# Altium schematic sheet Msi001.SchDoc
size A3
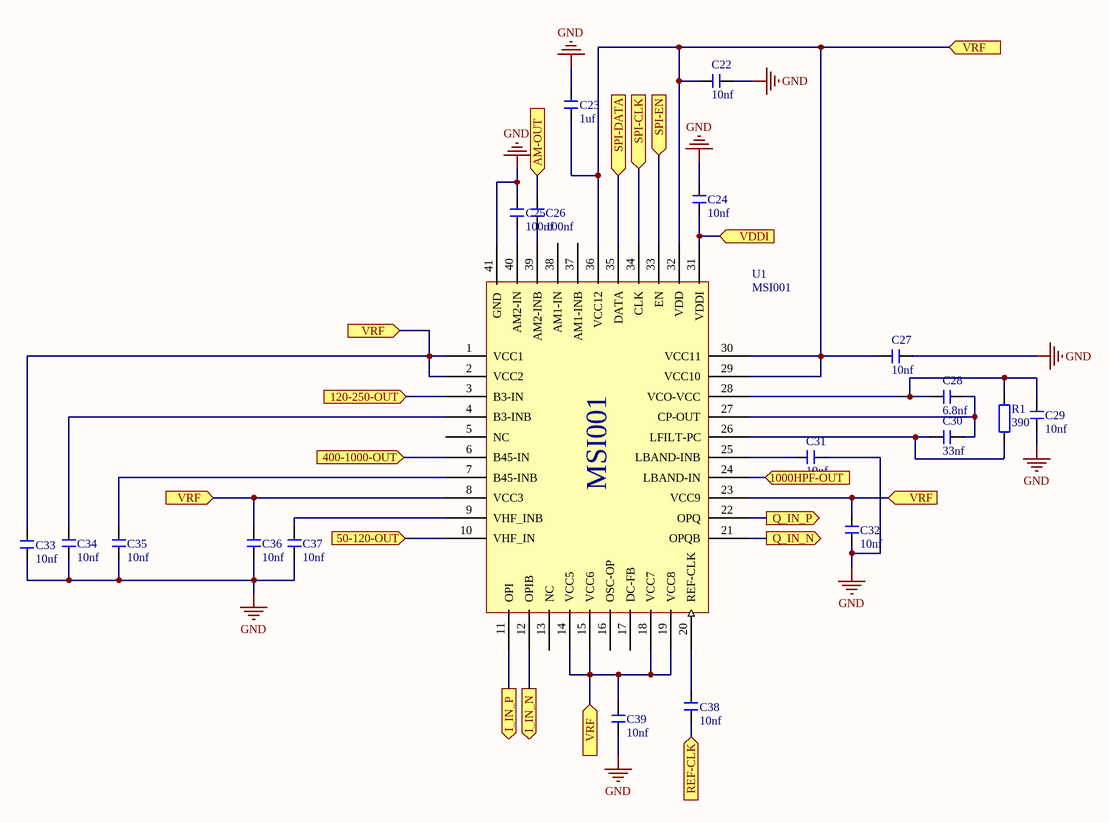
[diagram p0: Msi001.SchDoc]

## Parts
C22  10nf  [C 0603_M]
C23  1uf  [C 0603_M]
C24  10nf  [C 0603_M]
C25  100nf  [C 0603_M]
C26  100nf  [C 0603_M]
C27  10nf  [C 0603_M]
C28  6.8nf  [C 0603_M]
C29  10nf  [C 0603_M]
C30  33nf  [C 0603_M]
C31  10nf  [C 0603_M]
C32  10nf  [C 0603_M]
C33  10nf  [C 0603_M]
C34  10nf  [C 0603_M]
C35  10nf  [C 0603_M]
C36  10nf  [C 0603_M]
C37  10nf  [C 0603_M]
C38  10nf  [C 0603_M]
C39  10nf  [C 0603_M]
R1  390  [R 0603_M]
U1  MSI001  [QFN40 6X6_M]

## Ports
50-120-OUT (in), 120-250-OUT (in), 400-1000-OUT (in), 1000HPF-OUT (in), AM-OUT (in), I_IN_N (out), I_IN_P (out), Q_IN_N (out), Q_IN_P (out), REF-CLK (in), SPI-CLK (in), SPI-DATA (in), SPI-EN (in), VDDI (in), VRF (in)

## Nets
GND: C22.1 C23.2 C24.2 C25.2 C27.1 C29.2 C31.2 C32.2 C33.1 C34.1 C35.2 C36.1 C37.1 C39.2 U1.41(GND)
50-120-OUT: U1.10(VHF_IN) ; port 50-120-OUT
120-250-OUT: U1.3(B3-IN) ; port 120-250-OUT
400-1000-OUT: U1.6(B45-IN) ; port 400-1000-OUT
1000HPF-OUT: U1.24(LBAND-IN) ; port 1000HPF-OUT
AM-OUT: C26.2 ; port AM-OUT
I_IN_N: U1.12(OPIB) ; port I_IN_N
I_IN_P: U1.11(OPI) ; port I_IN_P
Q_IN_N: U1.21(OPQB) ; port Q_IN_N
Q_IN_P: U1.22(OPQ) ; port Q_IN_P
REF-CLK: C38.2 ; port REF-CLK
SPI-CLK: U1.34(CLK) ; port SPI-CLK
SPI-DATA: U1.35(DATA) ; port SPI-DATA
SPI-EN: U1.33(EN) ; port SPI-EN
VDDI: C24.1 U1.31(VDDI) ; port VDDI
VRF: C22.2 C23.1 C27.2 C32.1 C33.2 C36.2 C39.1 U1.1(VCC1) U1.2(VCC2) U1.8(VCC3) U1.14(VCC5) U1.15(VCC6) U1.18(VCC7) U1.19(VCC8) U1.23(VCC9) U1.29(VCC10) U1.30(VCC11) U1.32(VDD) U1.36(VCC12) ; port VRF
NetC25_1: C25.1 U1.40(AM2-IN)
NetC26_1: C26.1 U1.39(AM2-INB)
NetC28_1: C28.1 C30.1 U1.27(CP-OUT)
NetC28_2: C28.2 C29.1 R1.1 U1.28(VCO-VCC)
NetC30_2: C30.2 R1.2 U1.26(LFILT-PC)
NetC31_1: C31.1 U1.25(LBAND-INB)
NetC34_2: C34.2 U1.4(B3-INB)
NetC35_1: C35.1 U1.7(B45-INB)
NetC37_2: C37.2 U1.9(VHF_INB)
NetC38_1: C38.1 U1.20(REF-CLK)

Not connected (* = marked no-connect by the designer): U1 5(NC) 13(NC) 16(OSC-OP) 17(DC-FB) 37(AM1-INB) 38(AM1-IN)

## Library data of the parts
C22-C39 = C: 无极性贴片电容; 版权归属: 源创客; BOM名称: 无极性贴片电容; 学习资源: www.ooocke.com
R1 = R: 贴片电阻; 版权归属: 源创客; BOM名称: 贴片电阻; 学习资源: www.ooocke.com
U1 = MSI001: tuner